# EAGLE design XBee-Explorer-DongleV13 (EAGLE 5.11)
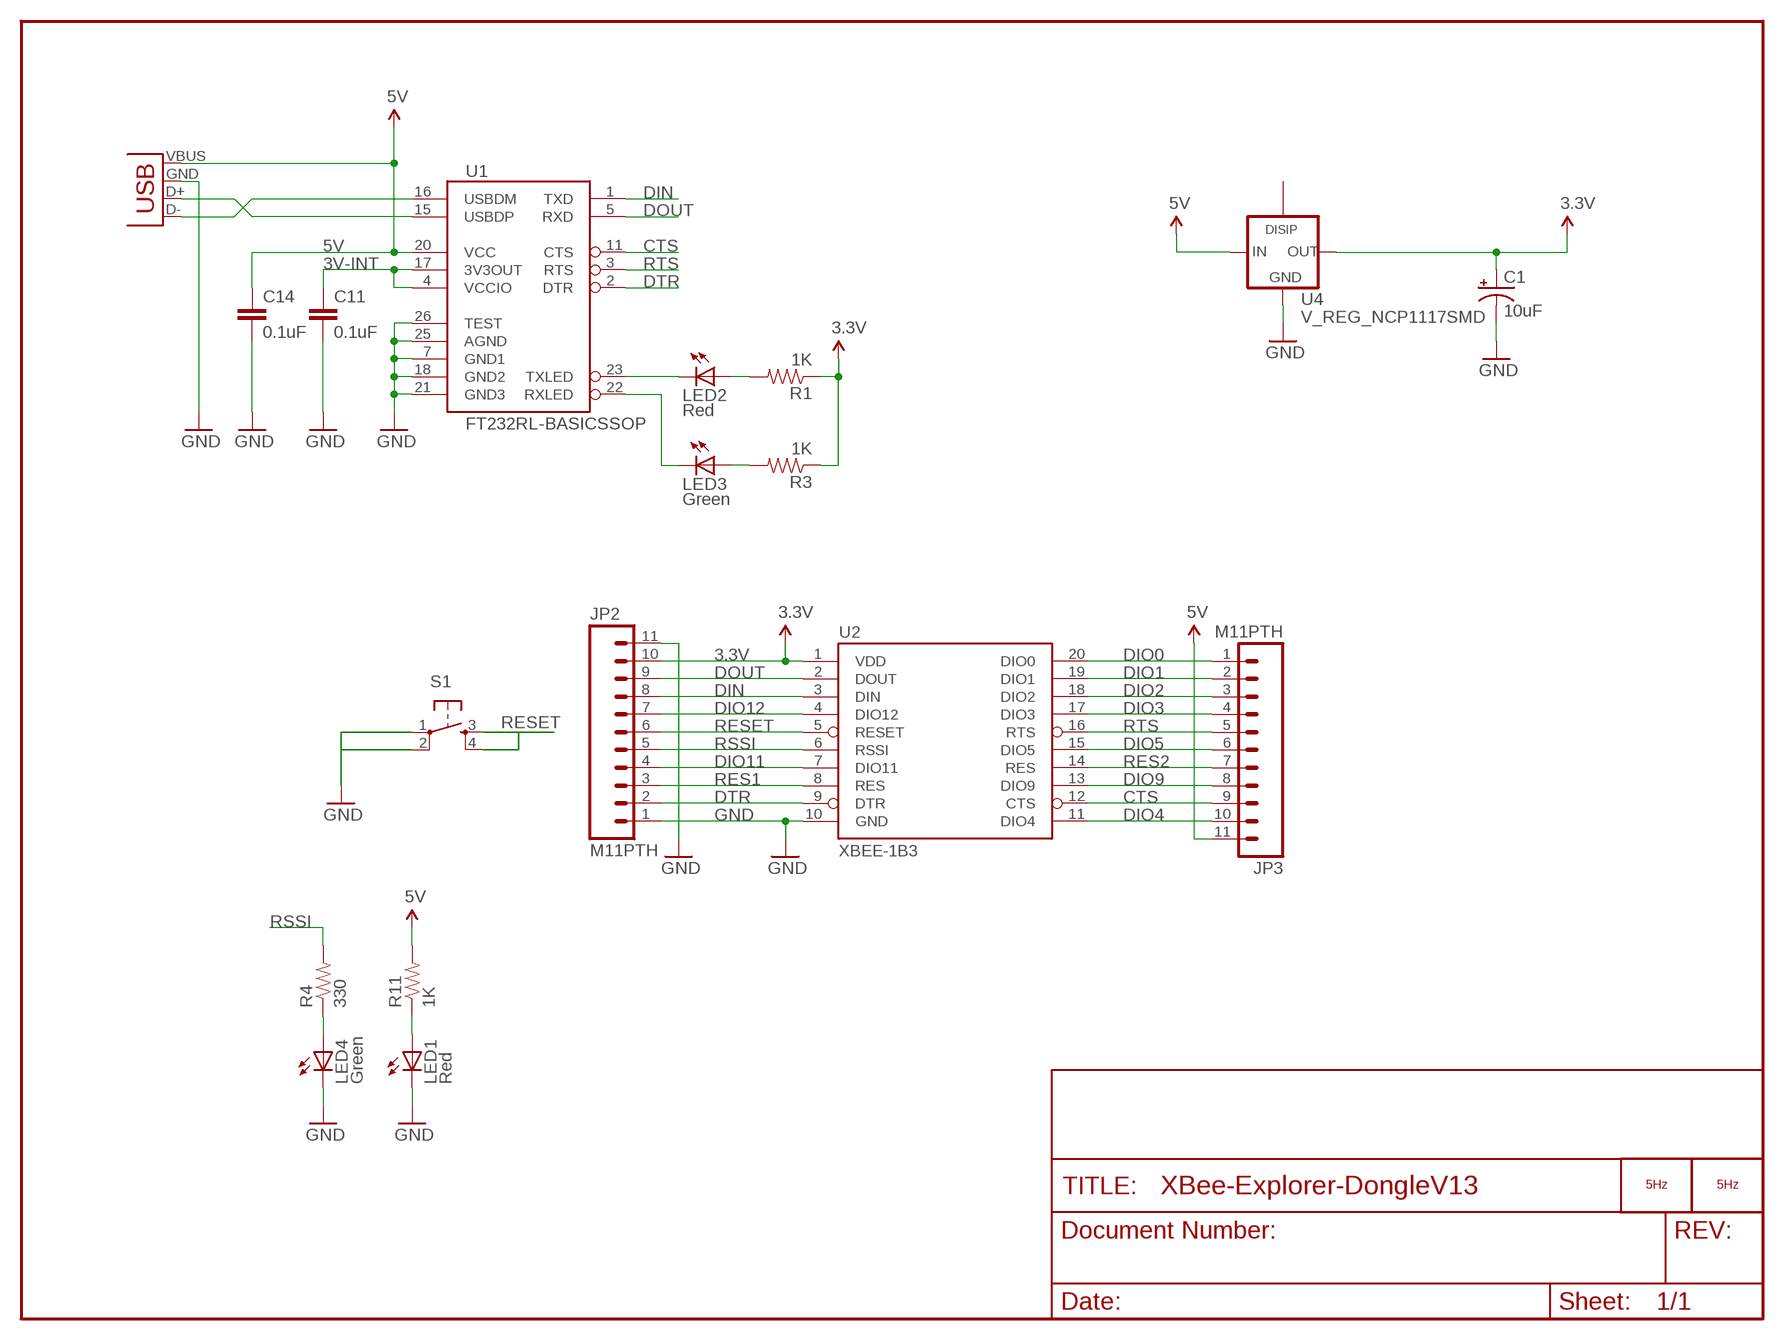
[diagram p0: schematic, sheet 1]

## Parts
C1  10uF  CAP_POL1206  [EIA3216]
C11  0.1uF  CAP0402-CAP  [0402-CAP]
C14  0.1uF  CAP0402-CAP  [0402-CAP]
JP2  M11PTH  [1X11]
JP3  M11PTH  [1X11]
LED1  Red  LED0603  [LED-0603]
LED2  Red  LED0603  [LED-0603]
LED3  Green  LED0603  [LED-0603]
LED4  Green  LED0603  [LED-0603]
LOGO1  LOGO_5HZ_MAIN_10MM  [5HZ_LOGO_MAIN_10MM]
LOGO2  LOGO_5HZ_H_10MM  [5HZ_LOGO_H_10MM]
R1  1K  RESISTOR0603-RES  [0603-RES]
R3  1K  RESISTOR0603-RES  [0603-RES]
R4  330  RESISTOR0603-RES  [0603-RES]
R11  1K  RESISTOR0603-RES  [0603-RES]
S1  TAC_SWITCHSMD  [TACTILE_SWITCH_SMD]
U1  FT232RL-BASICSSOP  [SSOP28DB]
U2  XBEE-1B3  [XBEE-SMD]
U4  V_REG_NCP1117SMD  [SOT223]
X2  USB-A-H  [USB-A-H]

## Nets
3.3V [vcc]: C1.A(+) JP2.10 R1.1 R3.1 U2.1(VDD) U4.2(OUT)
3V-INT [vcc]: C11.1 U1.4(VCCIO) U1.17(3V3OUT)
5V [vcc]: C14.1 JP3.11 R11.2 U1.20(VCC) U4.3(IN) X2.VBUS(GND)
CTS: JP3.9 U1.11(CTS) U2.12(CTS)
DIN: JP2.8 U1.1(TXD) U2.3(DIN)
DIO0: JP3.1 U2.20(DIO0)
DIO1: JP3.2 U2.19(DIO1)
DIO2: JP3.3 U2.18(DIO2)
DIO3: JP3.4 U2.17(DIO3)
DIO4: JP3.10 U2.11(DIO4)
DIO5: JP3.6 U2.15(DIO5)
DIO9: JP3.8 U2.13(DIO9)
DIO11: JP2.4 U2.7(DIO11)
DIO12: JP2.7 U2.4(DIO12)
DOUT: JP2.9 U1.5(RXD) U2.2(DOUT)
DTR: JP2.2 U1.2(DTR) U2.9(DTR)
GND [vcc]: C1.C(-) C11.2 C14.2 JP2.1 JP2.11 LED1.C LED4.C S1.1 S1.2 U1.7(GND1) U1.18(GND2) U1.21(GND3) U1.25(AGND) U1.26(TEST) U2.10(GND) U4.1(GND) X2.GND(VBUS)
N$1: LED2.A R1.2
N$2: LED4.A R4.1
N$3: U1.16(USBDM) X2.D-(D+)
N$4: LED3.A R3.2
N$7: U1.15(USBDP) X2.D+(D-)
N$38: LED1.A R11.1
RES1: JP2.3 U2.8(RES)
RES2: JP3.7 U2.14(RES)
RESET: JP2.6 S1.3 S1.4 U2.5(RESET)
RSSI: JP2.5 R4.2 U2.6(RSSI)
RTS: JP3.5 U1.3(RTS) U2.16(RTS)
RXLED: LED3.C U1.22(RXLED)
TXLED: LED2.C U1.23(TXLED)
Unconnected: U4.4

## Library data of the parts
C1 = SparkFun:CAP_POL: Capacitor Polarized These are standard SMD and PTH capacitors. Normally 10uF, 47uF, and 100uF in electrolytic and tantalum varieties. Always verify the external diameter of the through hole cap, it varies with capacity, voltage, and manufacturer. The EIA devices should be standard.
C11 C14 = SparkFun:CAP: Capacitor Standard 0603 ceramic capacitor, and 0.1" leaded capacitor.
JP2 JP3 = SparkFun:M11: Header 11 Standard 11-pin 0.1" header. Use with straight break away headers (SKU : PRT-00116), right angle break away headers (PRT-00553), swiss pins (PRT-00743), machine pins (PRT-00117), and female headers (PRT-00115).
LED1-LED4 = SparkFun:LED: LEDs Standard schematic elements and footprints for 5mm, 3mm, 1206, and 0603 sized LEDs. 5mm - Spark Fun Electronics SKU : COM-00529 (and others)
LOGO1 LOGO2 = 5hz-electronica:LOGO_5HZ: Logotipo 5Hz "según Pedro"
R1 R3 R4 R11 = SparkFun:RESISTOR: Resistor Basic schematic elements and footprints for 0603, 1206, and PTH resistors.
S1 = SparkFun:TAC_SWITCH: Momentary Switch Button commonly used for reset or general input. Spark Fun Electronics SKU : COM-00097
U1 = SparkFun:FT232RL-BASIC: USB UART This is the simplified version of the FT232RL unit. Only what you need, nothing you don't. Spark Fun Electronics SKU : COM-00650
U2 = SparkFun:XBEE-1
U4 = 5hz-electronica:V_REG_NCP1117: Voltage Regulator The NCP1117 series are low dropout positive voltage regulators that are capable of providing an output current that is in excess of 1.0 A with a maximum dropout voltage of 1.2 V at 800 mA over temperature. This series contains eight fixed output voltages of 1.5 V, 1.8 V, 2.0 V, 2.5 V, 2.85 V, 3.3 V, 5.0 V, and 12 V that have no minimum load requirement to maintain regulation. Also included is an adjustable output version that can be programmed from 1.25 V to 18.8 V with two external resistors. On chip trimming adjusts the reference/output voltage to within ±1.0% accuracy. Internal protection features consist of output current limiting, safe operating area compensation, and thermal shutdown. The NCP1117 series can operate with up to 20 V input. Devices are available in SOT-223 and DPAK packages.
X2 = SparkFun:USB: USB Connectors USB-B-PTH is fully proven SKU : PRT-00139 USB-miniB is fully proven SKU : PRT-00587 USB-A-PCB is untested. USB-A-H is throughly reviewed, but untested. Spark Fun Electronics SKU : PRT-00437 USB-B-SMT is throughly reviewed, but untested. Needs silkscreen touching up. USB-A-S has not been used/tested USB-MB-H has not been used/tested

## Net classes
0 default: width 0.203 mm
1 vcc: width 0.254 mm
2 gnd: width 0.254 mm

## Board
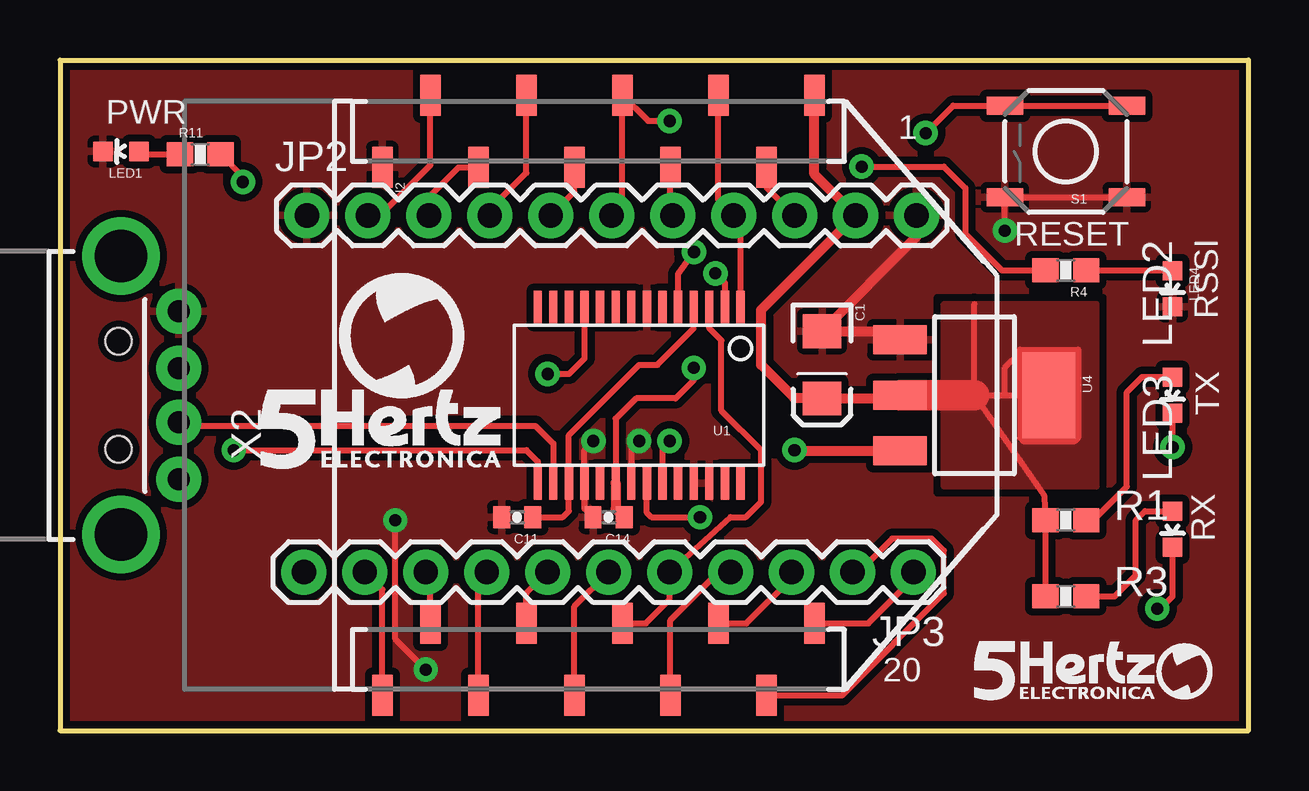
[diagram p1: board, top side]
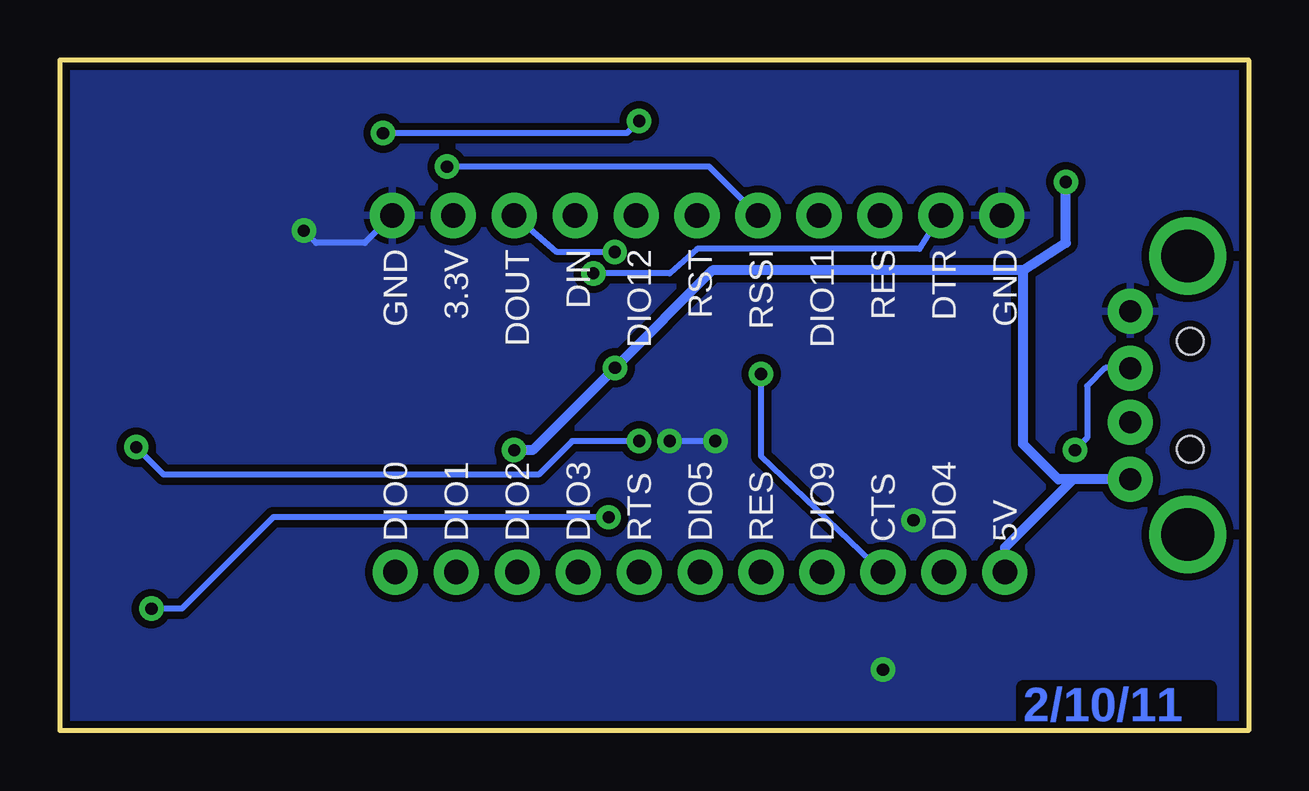
[diagram p2: board, bottom side, seen from below]

Size 49.53 x 27.94 mm. Coordinates in mm from the lower left corner, seen from the top.
Outline: 49.53,0 49.53,27.94 0,27.94 0,0 49.53,0
Copper layers (1*16): Top 0.035mm / dielectric 1.5mm / Bottom 0.035mm
Design rules "SparkFun": minimum track width 8mil, minimum drill 20mil, track to track 8mil, track to pad 8mil, pad to pad 8mil, via to via 8mil, smd to smd 8mil, copper to edge 10mil, drill to drill 8mil, minimum pad ring 12mil, minimum via ring 10mil, stop-mask expansion 4mil, vias tented up to drill 25mil, thermal gap 10mil

### Footprints (pad centres in the part's own frame; a part is rotated, then mirrored left to right if it is on the bottom)
EIA3216 = smd 1.4 x 1.6: A 1.4,0; C -1.4,0
0402-CAP = smd 0.7 x 0.9: 1 -0.65,0; 2 0.65,0
1X11 = drill 1.016 pad 1.88 round: 1 0,0; 2 2.54,0; 3 5.08,0; 4 7.62,0; 5 10.16,0; 6 12.7,0; 7 15.24,0; 8 17.78,0; 9 20.32,0; 10 22.86,0; 11 25.4,0
LED-0603 = smd 0.8 x 0.8: A 0,-0.75; C 0,0.75
0603-RES = smd 1.1 x 1: 1 -0.85,0; 2 0.85,0
TACTILE_SWITCH_SMD = smd 1.524 x 0.762: 1 -2.54,1.905; 2 2.54,1.905; 3 -2.54,-1.905; 4 2.54,-1.905
SSOP28DB = smd 0.348 x 1.397: 1 -4.225,-3.656; 2 -3.575,-3.656; 3 -2.925,-3.656; 4 -2.275,-3.656; 5 -1.625,-3.656; 6 -0.975,-3.656; 7 -0.325,-3.656; 8 0.325,-3.656; 9 0.975,-3.656; 10 1.625,-3.656; 11 2.275,-3.656; 12 2.925,-3.656; 13 3.575,-3.656; 14 4.225,-3.656; 15 4.225,3.656; 16 3.575,3.656; 17 2.925,3.656; 18 2.275,3.656; 19 1.625,3.656; 20 0.975,3.656; 21 0.325,3.656; 22 -0.325,3.656; 23 -0.975,3.656; 24 -1.625,3.656; 25 -2.275,3.656; 26 -2.925,3.656; 27 -3.575,3.656; 28 -4.225,3.656
XBEE-SMD = smd 1.7 x 0.85: 1 -12.5,20; 2 -9.5,18; 3 -12.5,16; 4 -9.5,14; 5 -12.5,12; 6 -9.5,10; 7 -12.5,8; 8 -9.5,6; 9 -12.5,4; 10 -9.5,2; 11 12.5,2; 12 9.5,4; 13 12.5,6; 14 9.5,8; 15 12.5,10; 16 9.5,12; 17 12.5,14; 18 9.5,16; 19 12.5,18; 20 9.5,20
SOT223 = smd 1.219 x 2.235: 1 -2.311,-3.099; 2 0,-3.099; 3 2.311,-3.099 | smd 3.6 x 2.2: 4 0,3.099
USB-A-H = drill 0.914 pad 1.88 round: D+ 2.4,1.127; D- 2.4,-1.127; GND 2.4,3.5; VBUS 2.4,-3.5 | drill 2.2 round: GND2 0,-5.8; GND3 0,5.8 | hole 1.1: -0.1,2.25; -0.1,-2.25

### Placement (x,y rotation side)
C1  31.75,15.24 270 top
C11  19.05,8.89 180 top
C14  22.86,8.89 180 top
JP2  10.29,21.46 0 top
JP3  35.56,6.6 180 top
LED1  2.54,24.13 90 top
LED2  46.35,13.97 180 top
LED3  46.35,8.38 180 top
LED4  46.35,18.41 180 top
LOGO1  8.38,10.92 0 top
LOGO2  38.1,1.27 0 top
R1  41.91,8.76 0 top
R3  41.91,5.59 0 top
R4  41.91,19.18 180 top
R11  5.84,24 0 top
S1  41.91,24.13 180 top
U1  24.13,13.97 180 top
U2  11.43,13.97 270 top
U4  38.1,13.97 270 top
X2  2.54,13.97 0 top

### Tracks (layer width: path | path; a pad name or v marks a point on that pad's centre or on a via)
3.3V
  Top 0.254: 34.87,13.84 U4.2 | 38.1,13.97 39.37,13.97 | 40.01,13.97 40.64,13.97 | 39.37,13.97 40.01,13.97 | 39.37,13.97 39.37,15.11 40.01,15.75 40.01,15.88 42.42,15.88 42.42,12.19 42.29,12.06 40.13,12.06 40.01,12.19 40.01,13.97 | 40.01,13.97 40.01,15.62 39.88,15.75 | 38.1,13.97 38.1,17.78 | R3.1 R1.1 41.01,9.79 38.1,13.97
  Top 0.406: U2.1 31.43,23.18 JP2.10 29.21,17.53 29.21,15.24 30.61,13.84 C1.A 34.87,13.84
  Top 1.27: U4.2 38.1,13.97
  pour Top: 36.83,17.78 43.18,17.78 43.18,10.16 36.83,10.16
3V-INT
  Top 0.254: U1.4 26.41,16.75 24.89,15.24 24.13,15.24 21.2,12.31 U1.17 21.2,9.14 20.95,8.89 C11.1
5V  (via drill 0.51)
  Top 0.254: U1.20 23.16,12.99 24,13.84 25.65,13.84 26.41,14.59 v26.41,15.1 | v30.61,11.68 30.63,11.66 | v7.62,22.86 7.62,23.07 R11.2
  Top 0.406: C14.1 23.5,8.89 23.16,9.23 U1.20 | v26.41,15.11 v26.42,15.11 v26.41,15.1 | 30.63,11.66 U4.3
  Bottom 0.254: X2.VBUS 7.31,10.47
  Bottom 0.406: v26.41,15.11 v26.42,15.11 | v26.41,15.11 26.41,15.12 22.35,19.18 9.4,19.18 | v30.61,11.68 29.83,11.68 v26.41,15.11 | 9.4,19.18 7.62,20.32 v7.62,22.86 | 7.31,10.47 10.16,7.62 JP3.11 | X2.VBUS 7.93,10.47 9.4,11.94 9.4,19.18
CTS  (via drill 0.51)
  Top 0.254: U1.11 21.86,15.51 21.21,14.86 v20.32,14.86 | U2.12 15.43,6.41 JP3.9
  Bottom 0.254: v20.32,14.86 20.32,11.43 JP3.9
DIN
  Top 0.254: U1.1 28.36,21.18 JP2.8 27.43,22.1 U2.3
DIO0
  Top 0.254: U2.20 33.68,4.47 35.56,6.35 JP3.1
DIO1
  Top 0.254: U2.19 32.59,1.47 36.83,5.71 36.83,7.49 36.32,8 34.67,8 33.27,6.6 JP3.2
DIO2
  Top 0.254: U2.18 28.6,4.47 30.48,6.35 JP3.3
DIO3
  Top 0.254: U2.17 25.43,4.6 27.43,6.6 JP3.4
DIO4
  Top 0.254: U2.11 13.43,5.87 JP3.10
DIO5
  Top 0.254: U2.15 21.43,5.17 JP3.6
DIO9
  Top 0.254: U2.13 17.43,6.25 JP3.8
DIO11
  Top 0.254: U2.7 19.43,23.24 17.91,21.72 JP2.4
DIO12
  Top 0.254: U2.4 25.43,21.62 JP2.7
DOUT  (via drill 0.51)
  Top 0.254: U1.5 25.75,19.02 v26.42,19.94 | U2.2 29.43,22.64 JP2.9
  Bottom 0.254: v26.42,19.94 28.83,19.94 JP2.9
DTR  (via drill 0.51)
  Top 0.254: U2.9 15.43,23.56 13.34,21.46 JP2.2 | U1.2 27.7,18.65 v27.3,19.05
  Bottom 0.254: v27.3,19.05 24.13,19.05 22.99,20.07 13.72,20.07 JP2.2
GND  (via drill 0.51)
  Top 0.254: v15.24,2.54 13.97,3.81 v13.97,8.76 | 34.64,16.64 U4.1 | S1.1 S1.2 v39.37,20.83 | C14.2 21.86,9.24 U1.18 21.84,11.68 v22.23,12.06 | v24.13,12.06 23.8,11.74 U1.21
  Top 0.406: C14.2 22.23,8.89 | 34.64,16.64 C1.C 35.69,20.58 JP2.11
  Bottom 0.254: v22.23,12.06 v24.13,12.06 | v39.37,20.83 38.86,20.32 36.83,20.32 JP2.11
  pour Bottom (isolate 0.305): 0,27.94 49.53,27.94 49.53,0 0,0
  pour Top (isolate 0.305, rank 2): 0,27.94 49.53,27.94 49.53,0 0,0
N$1
  Top 0.254: R1.2 43.05,8.76 44.45,10.16 44.45,14.1 45.09,14.73 46.34,14.73 LED2.A
N$2
  Top 0.254: R4.1 46.34,19.18 LED4.A
N$3
  Top 0.254: U1.16 20.55,11.96 19.81,12.7 5.08,12.7 X2.D-
N$4
  Top 0.254: LED3.A 46.34,9.14 45.21,9.14 44.83,8.76 44.83,6.48 43.94,5.59 R3.2
N$7  (via drill 0.51)
  Top 0.254: U1.15 19.94,10.29 | U1.15 | U1.15 | U1.15 19.91,11.2 19.43,11.68 v7.24,11.68
  Bottom 0.254: v7.24,11.68 6.73,12.19 6.73,14.35 5.97,15.11 4.96,15.11 X2.D+
N$38
  Top 0.254: R11.1 3.42,24 LED1.A
RES1
  Top 0.254: U2.8 16.61,23.47 15.37,22.23 JP2.3
RES2
  Top 0.254: U2.14 19.43,5.71 JP3.7
RESET  (via drill 0.51)
  Top 0.254: JP2.6 23.43,22.16 U2.5 24.5,25.4 v25.4,25.4 | v36.07,24.89 37.21,26.04 S1.4 S1.3
  Bottom 0.254: v36.07,24.89 25.91,24.89 v25.4,25.4
RSSI  (via drill 0.51)
  Top 0.254: U2.6 21.43,22.45 JP2.5 | R4.2 39.24,19.18 37.72,20.7 37.72,22.61 36.83,23.5 v33.4,23.5
  Bottom 0.254: v33.4,23.5 22.48,23.5 JP2.5
RTS
  Top 0.254: U1.3 27.05,16.76 27.56,16.26 27.56,13.34 29.21,11.68 29.21,9.53 28.57,8.89 27.94,8.89 JP3.5 25.4,5.46 24.41,4.47 U2.16
RXLED  (via drill 0.51)
  Top 0.254: U1.22 24.45,9.07 24.64,8.89 v26.67,8.89 | v45.72,5.08 45.85,5.08 46.35,5.59 LED3.C
  Bottom 0.254: v26.67,8.89 40.64,8.89 44.45,5.08 v45.72,5.08
TXLED  (via drill 0.51)
  Top 0.254: U1.23 25.11,11.77 v25.4,12.06 | v46.35,11.81 LED2.C
  Bottom 0.254: v25.4,12.06 28.19,12.06 29.59,10.67 45.21,10.67 v46.35,11.81

### Text on the board
Bottom: 2/10/11
tPlace: PWR | 1 | RESET | RSSI | TX | RX | 20
bPlace: GND | DTR | RES | DIO11 | RSSI | RST | DIO12 | DIN | DOUT | 3.3V | GND | 5V | DIO4 | CTS | DIO9 | RES | DIO5 | RTS | DIO3 | DIO2 | DIO1 | DIO0
tValues: XBee Socket Up | DNP | DNP | XBee Socket Up